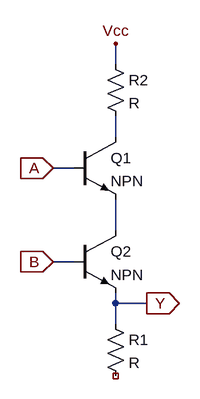
[diagram p0: schematic AND.asc]
AND.asc, the LTspice schematic file:
Version 4
SHEET 1 880 680
WIRE 240 -32 240 -64
WIRE 240 80 240 48
WIRE 176 128 144 128
WIRE 240 224 240 176
WIRE 176 272 144 272
WIRE 240 336 240 320
WIRE 288 336 240 336
WIRE 240 368 240 336
FLAG 144 128 A
IOPIN 144 128 In
FLAG 144 272 B
IOPIN 144 272 In
FLAG 240 -64 Vcc
FLAG 288 336 Y
IOPIN 288 336 Out
SYMBOL npn 176 80 R0
SYMATTR InstName Q1
SYMBOL npn 176 224 R0
SYMATTR InstName Q2
SYMBOL res 224 352 R0
SYMATTR InstName R1
SYMBOL res 224 -48 R0
SYMATTR InstName R2

The netlist it stands for:
* AND.asc
Q1 N001 A N002 0 NPN
Q2 N002 B Y 0 NPN
R1 Y NC_01 R
R2 Vcc N001 R
.model NPN NPN
.model PNP PNP
.lib standard.bjt
.backanno
.end